# EAGLE schematic grbl_shield_hector (EAGLE 8.7.1)
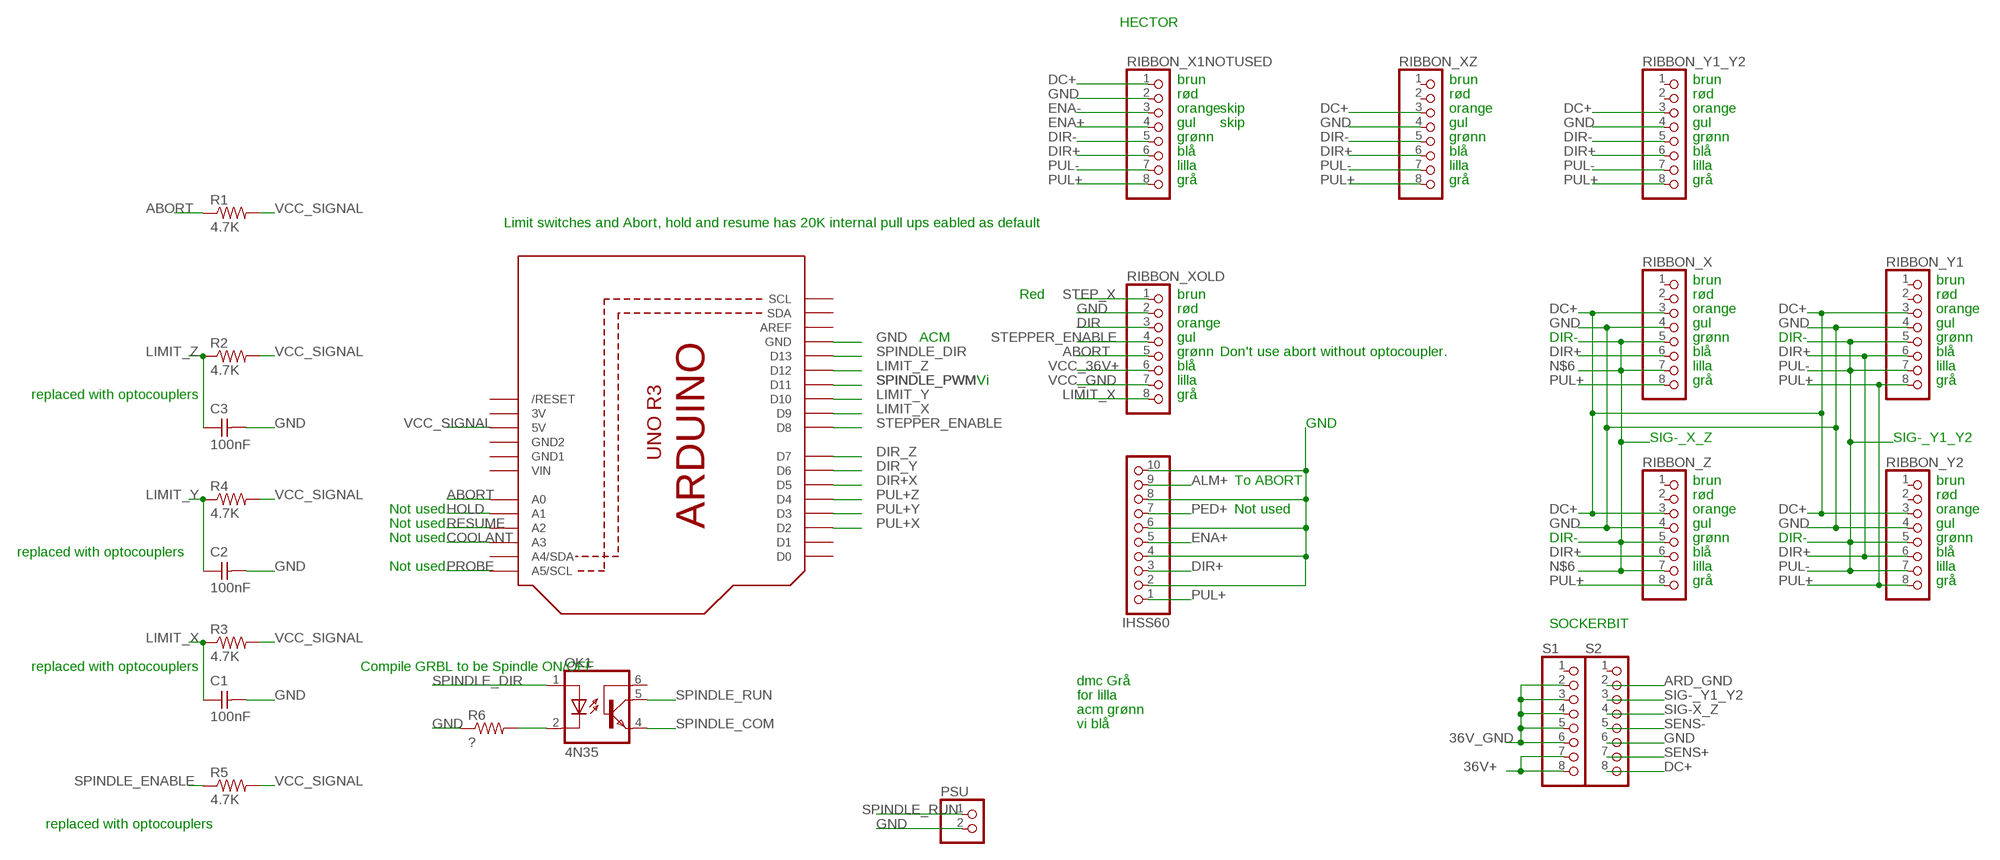
[diagram p0: schematic, sheet 1]

## Parts
C1  100nF  CAP-UNPOLARIZEDFAB  [C1206FAB]
C2  100nF  CAP-UNPOLARIZEDFAB  [C1206FAB]
C3  100nF  CAP-UNPOLARIZEDFAB  [C1206FAB]
IHSS60  PINHD-1X10  [1X10]
OK1  4N35  [DIL06]
PSU  PINHD-1X2  [1X02]
Q1  ARDUINOR3-NOIOREF-NOTEXT  [ARDUINOR3-NOTEXT-NOIOREF]
R1  4.7K  RES-US1206FAB  [R1206FAB]
R2  4.7K  RES-US1206FAB  [R1206FAB]
R3  4.7K  RES-US1206FAB  [R1206FAB]
R4  4.7K  RES-US1206FAB  [R1206FAB]
R5  4.7K  RES-US1206FAB  [R1206FAB]
R6  ?  RES-US1206FAB  [R1206FAB]
RIBBON_X  PINHD-1X8  [1X08]
RIBBON_X1NOTUSED  PINHD-1X8  [1X08]
RIBBON_XOLD  PINHD-1X8  [1X08]
RIBBON_XZ  PINHD-1X8  [1X08]
RIBBON_Y1  PINHD-1X8  [1X08]
RIBBON_Y1_Y2  PINHD-1X8  [1X08]
RIBBON_Y2  PINHD-1X8  [1X08]
RIBBON_Z  PINHD-1X8  [1X08]
S1  PINHD-1X8  [1X08]
S2  PINHD-1X8  [1X08]

## Nets
36V+: S1.7 S1.8
36V_GND: S1.2 S1.3 S1.4 S1.5 S1.6
ABORT: Q1.A0 R1.1 RIBBON_XOLD.5
ALM+: IHSS60.9
ARD_GND: S2.2
COOLANT: Q1.A3
DC+: RIBBON_X1NOTUSED.1 RIBBON_X.3 RIBBON_XZ.3 RIBBON_Y1.3 RIBBON_Y1_Y2.3 RIBBON_Y2.3 RIBBON_Z.3 S2.8
DIR: RIBBON_XOLD.3
DIR+: IHSS60.3 RIBBON_X1NOTUSED.6 RIBBON_X.6 RIBBON_XZ.6 RIBBON_Y1.6 RIBBON_Y1_Y2.6 RIBBON_Y2.6 RIBBON_Z.6
DIR+X: Q1.D5
DIR-: RIBBON_X1NOTUSED.5 RIBBON_XZ.5 RIBBON_Y1_Y2.5
DIR_Y: Q1.D6
DIR_Z: Q1.D7
ENA+: IHSS60.5 RIBBON_X1NOTUSED.4
ENA-: RIBBON_X1NOTUSED.3
GND: C1.2 C2.2 C3.2 PSU.2 Q1.GND R6.1 RIBBON_X1NOTUSED.2 RIBBON_X.4 RIBBON_XOLD.2 RIBBON_XZ.4 RIBBON_Y1.4 RIBBON_Y1_Y2.4 RIBBON_Y2.4 RIBBON_Z.4 S2.6
HOLD: Q1.A1
LIMIT_X: C1.1 Q1.D9 R3.1 RIBBON_XOLD.8
LIMIT_Y: C2.1 Q1.D10 R4.1
LIMIT_Z: C3.1 Q1.D12 R2.1
N$1: OK1.2(C) R6.2
N$6: RIBBON_X.5 RIBBON_X.7 RIBBON_Z.5 RIBBON_Z.7
N$14: IHSS60.2 IHSS60.4 IHSS60.6 IHSS60.8 IHSS60.10
PED+: IHSS60.7
PROBE: Q1.A5(A5/SCL)
PUL+: IHSS60.1 RIBBON_X1NOTUSED.8 RIBBON_X.8 RIBBON_XZ.8 RIBBON_Y1.8 RIBBON_Y1_Y2.8 RIBBON_Y2.8 RIBBON_Z.8
PUL+X: Q1.D2
PUL+Y: Q1.D3
PUL+Z: Q1.D4
PUL-: RIBBON_X1NOTUSED.7 RIBBON_XZ.7 RIBBON_Y1.5 RIBBON_Y1.7 RIBBON_Y1_Y2.7 RIBBON_Y2.5 RIBBON_Y2.7
RESUME: Q1.A2
SENS+: S2.7
SENS-: S2.5
SIG-_Y1_Y2: S2.3
SIG-X_Z: S2.4
SPINDLE_COM: OK1.4(EMI)
SPINDLE_DIR: OK1.1(A) Q1.D13
SPINDLE_ENABLE: R5.1
SPINDLE_PWM: Q1.D11
SPINDLE_RUN: OK1.5(COL) PSU.1
STEP_X: RIBBON_XOLD.1
STEPPER_ENABLE: Q1.D8 RIBBON_XOLD.4
VCC_36V+: RIBBON_XOLD.6
VCC_GND: RIBBON_XOLD.7
VCC_SIGNAL: Q1.5V R1.2 R2.2 R3.2 R4.2 R5.2
Unconnected: OK1.6(BAS) Q1.A4(A4/SDA) Q1.AREF Q1.D0 Q1.D1 Q1.RESET(/RESET) Q1.SCL Q1.SDA RIBBON_X.1 RIBBON_X.2 RIBBON_XZ.1 RIBBON_XZ.2 RIBBON_Y1.1 RIBBON_Y1.2 RIBBON_Y1_Y2.1 RIBBON_Y1_Y2.2 RIBBON_Y2.1 RIBBON_Y2.2 RIBBON_Z.1 RIBBON_Z.2 S1.1 S2.1

## Notes on the sheet
- HECTOR
- brun | brun | brun
- rød | rød | rød
- orange | skip | orange | orange
- gul | skip | gul | gul
- grønn | grønn | grønn
- blå | blå | blå
- lilla | lilla | lilla
- grå | grå | grå
- Limit switches and Abort, hold and resume has 20K internal pull ups eabled as default
- brun | brun
- Red | brun | rød | rød
- rød | orange | orange
- orange | gul | gul
- ACM | gul | DIR- | grønn | DIR- | grønn
- grønn | Don't use abort without optocoupler. | blå | blå
- blå | lilla | lilla
- Vi | lilla | grå | grå
- replaced with optocouplers | grå
- GND
- SIG-_X_Z | SIG-_Y1_Y2
- To ABORT | brun | brun
- rød | rød
- Not used | Not used | orange | orange
- Not used | gul | gul
- Not used | DIR- | grønn | DIR- | grønn
- replaced with optocouplers | blå | blå
- Not used | lilla | lilla
- grå | grå
- SOCKERBIT
- replaced with optocouplers | Compile GRBL to be Spindle ON/OFF
- dmc Grå
- for lilla
- acm grønn
- vi blå
- replaced with optocouplers

## Power pins joined to a net without a drawn wire
3V: Q1.3V
GND1: Q1.GND1
GND2: Q1.GND2
VIN: Q1.VIN

## Library data of the parts
C1-C3 = fab:CAP-UNPOLARIZED
IHSS60 = pinhead:PINHD-1X10: PIN HEADER
OK1 = optocoupler-2:4N35: MOTOROLA OPTO COUPLER
PSU = pinhead:PINHD-1X2: PIN HEADER
Q1 = adafruit:ARDUINOR3-NOIOREF
R1-R6 = fab:RES-US: Resistor (US Symbol) Variants with postfix FAB are widened to allow the routing of internal traces
RIBBON_X RIBBON_X1NOTUSED RIBBON_XOLD RIBBON_XZ RIBBON_Y1 RIBBON_Y1_Y2 RIBBON_Y2 RIBBON_Z S1 S2 = pinhead:PINHD-1X8: PIN HEADER